# Altium schematic sheet MCU.SchDoc
size 279 x 215 mm; SheetNumber: 5; SheetTotal: 6; SPICEModelCacheLZXJEGGY: <root> / <DocumentId>LZXJEGGY</DocumentId> / <CacheFrame Number="0"> / <Model Name="cap" Kind="MDL"> / <Text>*Default semiconductor capacitor / .MODEL CAP C()</Text> / </Model> / </CacheFrame> / </root>
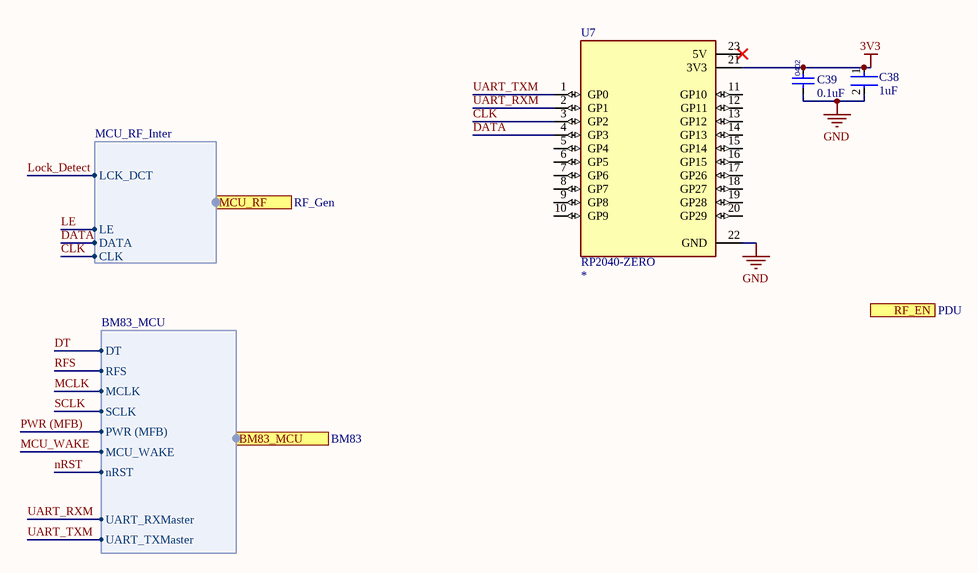
[diagram p0: MCU.SchDoc]

## Parts
C38  1uF  [FP-GRM155-0_1-IPC_C]
C39  0.1uF  [FP-CC0402-IPC_B]
U7  RP2040-ZERO  [MODULE_RP2040-ZERO]

## Ports
BM83_MCU (harness BM83_MCU, see BM83), MCU_RF (harness MCU_RF_Inter, see RF_Gen), RF_EN (in, see PDU)

## Harnesses
BM83_MCU: MCLK, MCU_WAKE, SCLK, PWR (MFB), RFS, DT, nRST, UART_TXMaster, UART_RXMaster
MCU_RF_Inter: LCK_DCT, LE, DATA, CLK

## Nets
3V3: C38.1 C39.2 U7.21(3V3)
GND: C38.2 C39.1 U7.22(GND)
CLK: U7.3(GP2) ; port MCU_RF.CLK
DATA: U7.4(GP3) ; port MCU_RF.DATA
DT: port BM83_MCU.DT
LE: port MCU_RF.LE
Lock_Detect: port MCU_RF.LCK_DCT
MCLK: port BM83_MCU.MCLK
MCU_WAKE: port BM83_MCU.MCU_WAKE
nRST: port BM83_MCU.nRST
PWR (MFB): port BM83_MCU.PWR (MFB)
RFS: port BM83_MCU.RFS
SCLK: port BM83_MCU.SCLK
UART_RXM: U7.2(GP1) ; port BM83_MCU.UART_RXMaster
UART_TXM: U7.1(GP0) ; port BM83_MCU.UART_TXMaster

Not connected (* = marked no-connect by the designer): U7 5(GP4) 6(GP5) 7(GP6) 8(GP7) 9(GP8) 10(GP9) 11(GP10) 12(GP11) 13(GP12) 14(GP13) 15(GP14) 16(GP15) 17(GP26) 18(GP27) 19(GP28) 20(GP29) 23(5V)*

## Notes on the sheet
- Title
- Designer
- Revision
- Date:
- File:
- (in symbol CMP-Cap-00006-1) 0402

## Library data of the parts
C38 = CMP-06035-028020-1: Chip Multilayer Ceramic Capacitors for General Purpose, 0402, 1.0uF, X7R, 15%, 10%, 10V / GRM155Z71A105KE01D
C39 = CMP-Cap-00006-1: Ceramic Capacitor, Multilayer, Ceramic, 16V, 10% +Tol, 10% -Tol, X7R, 15% TC, 0.1uF, Surface Mount, 0402; Dielectric: XR7; Capacitance: 100nF; Tolerance: 10%; Voltage Rating: 16V
U7 = CMP-202-000000-1: Low-Cost, High-Performance Pico-Like MCU Board Based On Raspberry Pi Microcontroller RP2040; MF: Waveshare Electronics; Component Type: Standard; Source: RP2040-ZERO.SchLib; SnapEDA_Link: https://www.snapeda.com/parts/RP2040-ZERO/Waveshare+Electronics/view-part/?ref=snap; Value: *; Package: Package; Design Item ID: RP2040-ZERO; Check_prices: https://www.snapeda.com/parts/RP2040-ZERO/Waveshare+Electronics/view-part/?ref=eda; Pin Count: 23; MP: RP2040-ZERO